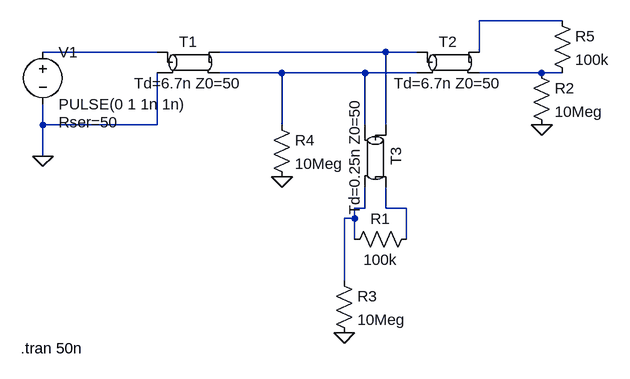
[diagram p0: schematic stub.asc]
stub.asc, the LTspice schematic file:
Version 4
SHEET 1 880 680
WIRE 704 64 576 64
WIRE 80 112 -96 112
WIRE 432 112 176 112
WIRE 480 112 432 112
WIRE 576 112 576 64
WIRE 272 144 176 144
WIRE 400 144 272 144
WIRE 480 144 400 144
WIRE 672 144 576 144
WIRE 704 144 672 144
WIRE -96 224 -96 192
WIRE 80 224 80 144
WIRE 80 224 -96 224
WIRE 272 224 272 144
WIRE 400 224 400 144
WIRE 432 224 432 112
WIRE -96 272 -96 224
WIRE 400 352 400 320
WIRE 400 352 384 352
WIRE 432 352 432 320
WIRE 464 352 432 352
WIRE 384 368 384 352
WIRE 384 368 368 368
WIRE 384 400 384 368
WIRE 464 400 464 352
WIRE 368 464 368 368
FLAG -96 272 0
FLAG 672 224 0
FLAG 368 544 0
FLAG 272 304 0
SYMBOL voltage -96 96 R0
WINDOW 123 0 0 Left 2
WINDOW 39 24 124 Left 2
SYMATTR InstName V1
SYMATTR Value PULSE(0 1 1n 1n)
SYMATTR SpiceLine Rser=50
SYMBOL tline 128 128 R0
SYMATTR InstName T1
SYMATTR Value Td=6.7n Z0=50
SYMBOL tline 528 128 R0
SYMATTR InstName T2
SYMATTR Value Td=6.7n Z0=50
SYMBOL tline 416 272 R90
SYMATTR InstName T3
SYMATTR Value Td=0.25n Z0=50
SYMBOL res 480 384 R90
WINDOW 0 0 56 VBottom 2
WINDOW 3 32 56 VTop 2
SYMATTR InstName R1
SYMATTR Value 100k
SYMBOL res 656 128 R0
SYMATTR InstName R2
SYMATTR Value 10Meg
SYMBOL res 352 448 R0
SYMATTR InstName R3
SYMATTR Value 10Meg
SYMBOL res 256 208 R0
SYMATTR InstName R4
SYMATTR Value 10Meg
SYMBOL res 688 48 R0
SYMATTR InstName R5
SYMATTR Value 100k
TEXT -130 568 Left 2 !.tran 50n

The netlist it stands for:
* stub.asc
V1 N002 0 PULSE(0 1 1n 1n) Rser=50
T1 N002 0 N003 N004 Td=6.7n Z0=50
T2 N003 N004 N001 N005 Td=6.7n Z0=50
T3 N003 N004 N007 N006 Td=0.25n Z0=50
R1 N007 N006 100k
R2 N005 0 10Meg
R3 N006 0 10Meg
R4 N004 0 10Meg
R5 N001 N005 100k
.tran 50n
.backanno
.end